# Altium schematic sheet blok_diagram.SchDoc: Kablosuz Guvenlik Dedektörü
size A4; DrawnBy: Dogukan Akca; SheetNumber: 2
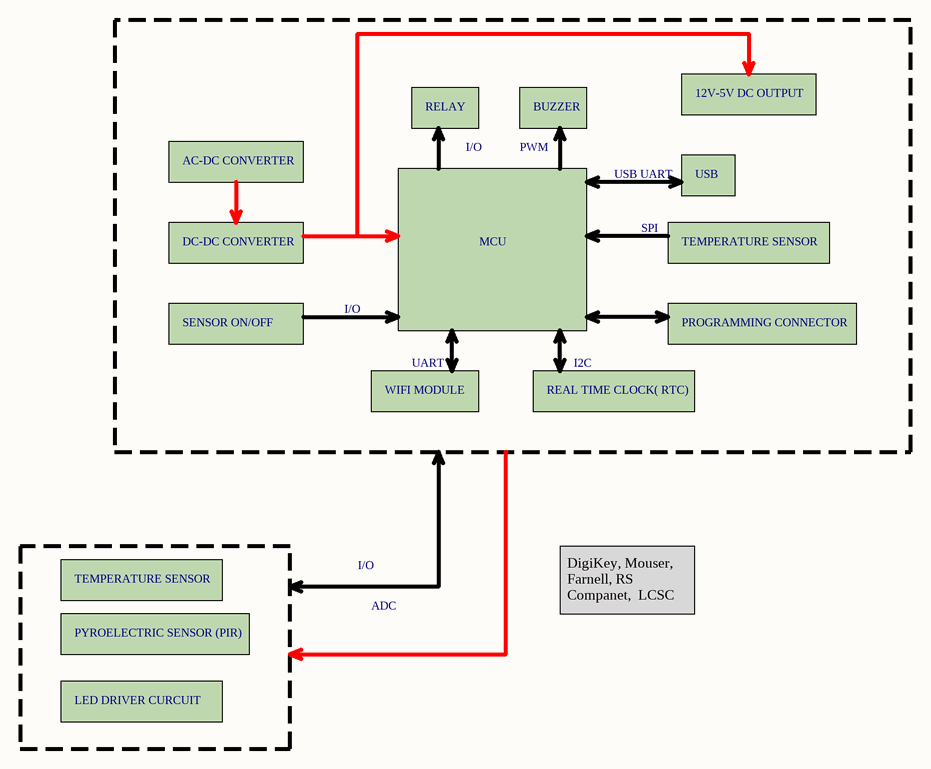
[diagram p0: blok_diagram.SchDoc]

## Notes on the sheet
- RELAY
- BUZZER
- 12V-5V DC OUTPUT
- AC-DC CONVERTER
- I/O
- PWM
- USB UART
- USB
- DC-DC CONVERTER
- MCU
- SPI
- TEMPERATURE SENSOR
- SENSOR ON/OFF
- UART
- I2C
- PROGRAMMING CONNECTOR
- WIFI MODULE
- REAL TIME CLOCK( RTC)
- PYROELECTRIC SENSOR (PIR)
- ADC
- DigiKey, Mouser, Farnell, RS Companet,  LCSC
- LED DRIVER CURCUIT